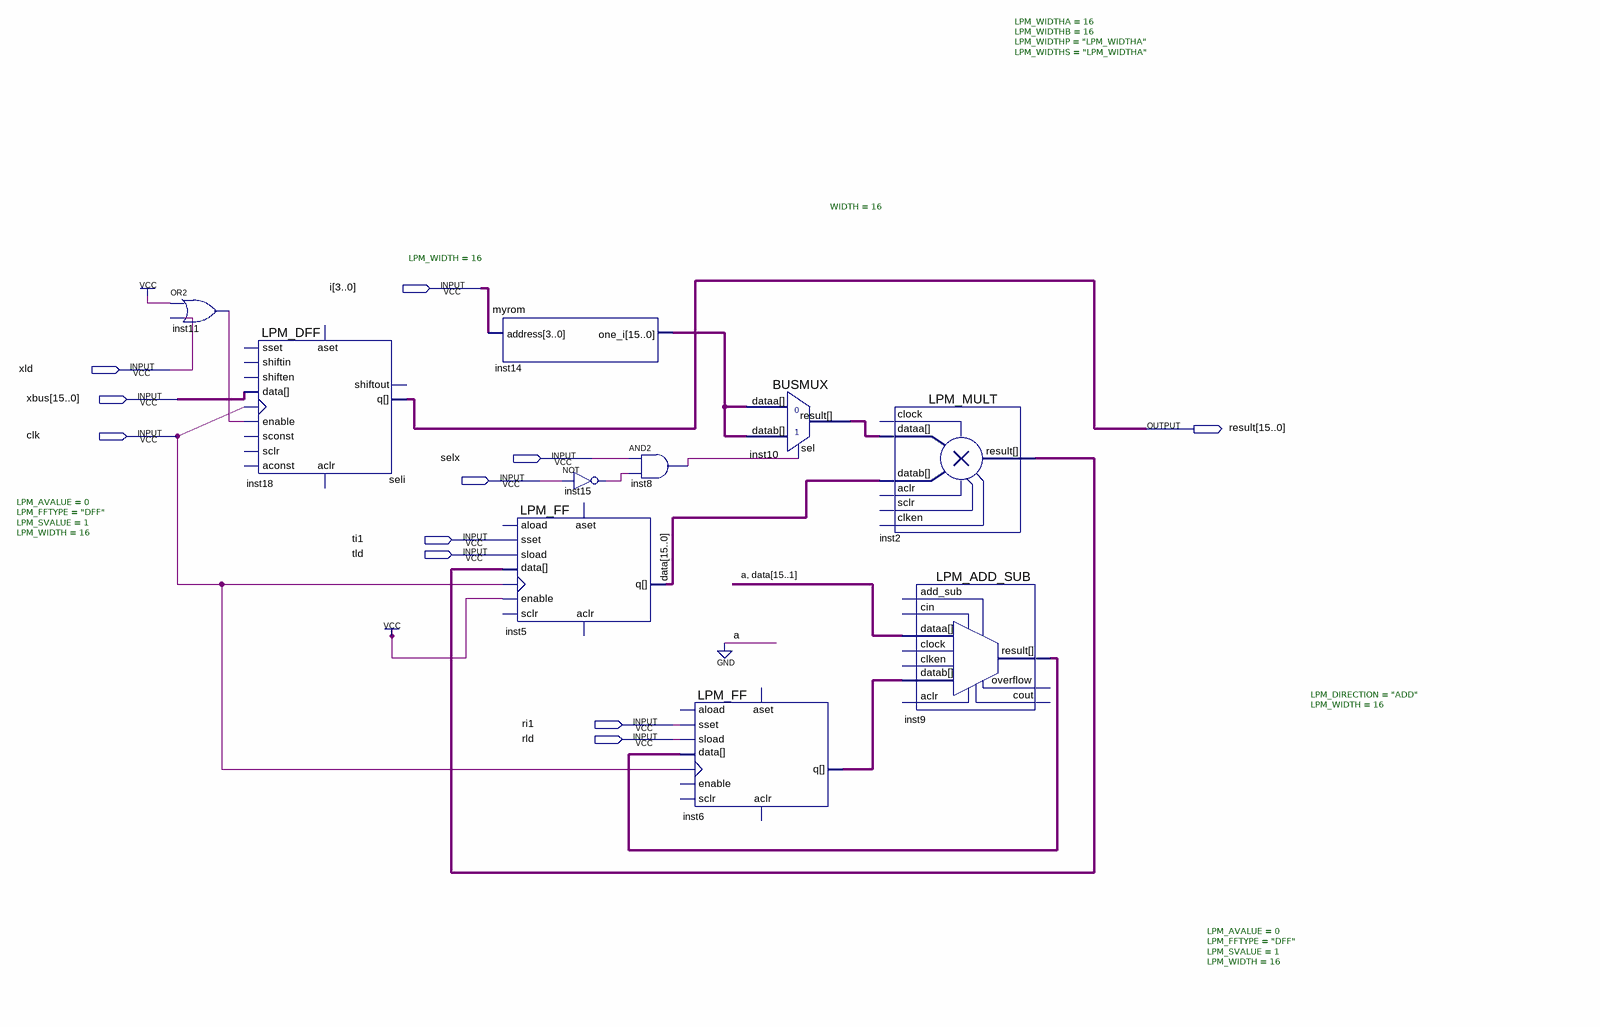
[diagram p0: schematic sheet]
// Quartus schematic cosh.bdf as structural Verilog: 10 symbols, 11 pins
module cosh (
  input  [3:0] i,
  input  xld,
  input  [15:0] xbus,
  input  clk,
  input  selx,
  input  seli,
  input  ti1,
  input  tld,
  input  ri1,
  input  rld,
  output [15:0] result
);

  wire inst8_out, inst11_out, inst15_out;
  wire [15:0] data, inst2_result, inst6_q, inst9_result, inst10_result, inst14_one_i;

  or inst11 (inst11_out, 1'b1, xld);
  LPM_DFF #(.LPM_WIDTH(16)) inst18 (
    .enable(inst11_out), .clock(clk), .data(xbus), .q(result));  // open: shiftin, shiften, aconst, sclr, sconst, sset, aset, aclr, shiftout
  myrom inst14 (.address(i), .one_i(inst14_one_i));
  LPM_FF #(.LPM_AVALUE(0), .LPM_FFTYPE("DFF"), .LPM_SVALUE(1), .LPM_WIDTH(16)) inst5 (
    .enable(1'b1), .clock(clk), .sset(ti1), .sload(tld), .data(inst2_result), .q(data));  // open: aload, aset, sclr, aclr
  not inst15 (inst15_out, seli);
  and inst8 (inst8_out, selx, inst15_out);
  LPM_FF #(.LPM_AVALUE(0), .LPM_FFTYPE("DFF"), .LPM_SVALUE(1), .LPM_WIDTH(16)) inst6 (
    .clock(clk), .sset(ri1), .sload(rld), .data(inst9_result), .q(inst6_q));  // open: enable, aload, aset, sclr, aclr
  BUSMUX #(.WIDTH(16)) inst10 (.datab(inst14_one_i), .sel(inst8_out), .dataa(inst14_one_i), .result(inst10_result));
  LPM_MULT #(.LPM_WIDTHA(16), .LPM_WIDTHB(16), .LPM_WIDTHP("LPM_WIDTHA"), .LPM_WIDTHS("LPM_WIDTHA")) inst2 (
    .dataa(inst10_result), .datab(data), .result(inst2_result));  // open: clock, aclr, sclr, clken
  LPM_ADD_SUB #(.LPM_DIRECTION("ADD"), .LPM_WIDTH(16)) inst9 (
    .datab(inst6_q), .dataa({1'b0, data[15:1]}), .result(inst9_result));  // open: add_sub, cin, aclr, clock, clken, cout, overflow
endmodule
